# Altium schematic sheet LMS7002M_A.SchDoc
size 297 x 209 mm
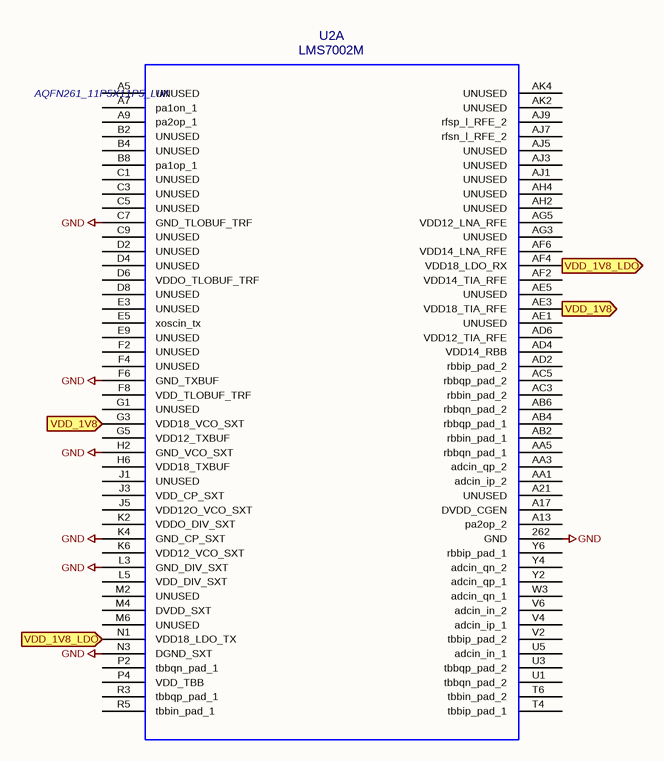
[diagram p0: LMS7002M_A.SchDoc]

## Parts
U2  LMS7002M  [AQFN261_11P5X11P5_LIM]  (part A of 3)

## Ports
VDD_1V8 (in), VDD_1V8_LDO (in)

## Nets
GND: U2.262(GND) U2.C7(GND_TLOBUF_TRF) U2.F6(GND_TXBUF) U2.H2(GND_VCO_SXT) U2.K4(GND_CP_SXT) U2.L3(GND_DIV_SXT) U2.N3(DGND_SXT)
VDD_1V8: U2.AE3(VDD18_TIA_RFE) U2.G3(VDD18_VCO_SXT) ; port VDD_1V8
VDD_1V8_LDO: U2.AF4(VDD18_LDO_RX) U2.N1(VDD18_LDO_TX) ; port VDD_1V8_LDO

Not connected (* = marked no-connect by the designer): U2 A5(UNUSED) A7(pa1on_1) A9(pa2op_1) A13(pa2op_2) A17(DVDD_CGEN) A21(UNUSED) AA1(adcin_ip_2) AA3(adcin_qp_2) AA5(rbbqn_pad_1) AB2(rbbin_pad_1) AB4(rbbqp_pad_1) AB6(rbbqn_pad_2) AC3(rbbin_pad_2) AC5(rbbqp_pad_2) AD2(rbbip_pad_2) AD4(VDD14_RBB) AD6(VDD12_TIA_RFE) AE1(UNUSED) AE5(UNUSED) AF2(VDD14_TIA_RFE) AF6(VDD14_LNA_RFE) AG3(UNUSED) AG5(VDD12_LNA_RFE) AH2(UNUSED) AH4(UNUSED) AJ1(UNUSED) AJ3(UNUSED) AJ5(UNUSED) AJ7(rfsn_l_RFE_2) AJ9(rfsp_l_RFE_2) AK2(UNUSED) AK4(UNUSED) B2(UNUSED) B4(UNUSED) B8(pa1op_1) C1(UNUSED) C3(UNUSED) C5(UNUSED) C9(UNUSED) D2(UNUSED) D4(UNUSED) D6(VDDO_TLOBUF_TRF) D8(UNUSED) E3(UNUSED) E5(xoscin_tx) E9(UNUSED) F2(UNUSED) F4(UNUSED) F8(VDD_TLOBUF_TRF) G1(UNUSED) G5(VDD12_TXBUF) H6(VDD18_TXBUF) J1(UNUSED) J3(VDD_CP_SXT) J5(VDD12O_VCO_SXT) K2(VDDO_DIV_SXT) K6(VDD12_VCO_SXT) L5(VDD_DIV_SXT) M2(UNUSED) M4(DVDD_SXT) M6(UNUSED) P2(tbbqn_pad_1) P4(VDD_TBB) R3(tbbqp_pad_1) R5(tbbin_pad_1) T4(tbbip_pad_1) T6(tbbin_pad_2) U1(tbbqn_pad_2) U3(tbbqp_pad_2) U5(adcin_in_1) V2(tbbip_pad_2) V4(adcin_ip_1) V6(adcin_in_2) W3(adcin_qn_1) Y2(adcin_qp_1) Y4(adcin_qn_2) Y6(rbbip_pad_1)

## Notes on the sheet
- 1
- 2
- 3
- 4
- 5
- 6
- A
- B
- C
- D
- Title:
- File: LMS7002M_A.kicad_sch
- Sheet: /
- KiCad E.D.A.  kicad (5.1.4)-1
- Size: A4
- Date:
- Rev:
- Id: 1/1

## Library data of the parts
U2 = LMS7002M: Value: LMS7002M